# Altium schematic sheet M7.SchDoc
size A0; Organization: Altium Limited; Address1: L3, 12a Rodborough Rd; Address2: Frenchs Forest; Address3: NSW; Address4: Australia 2086
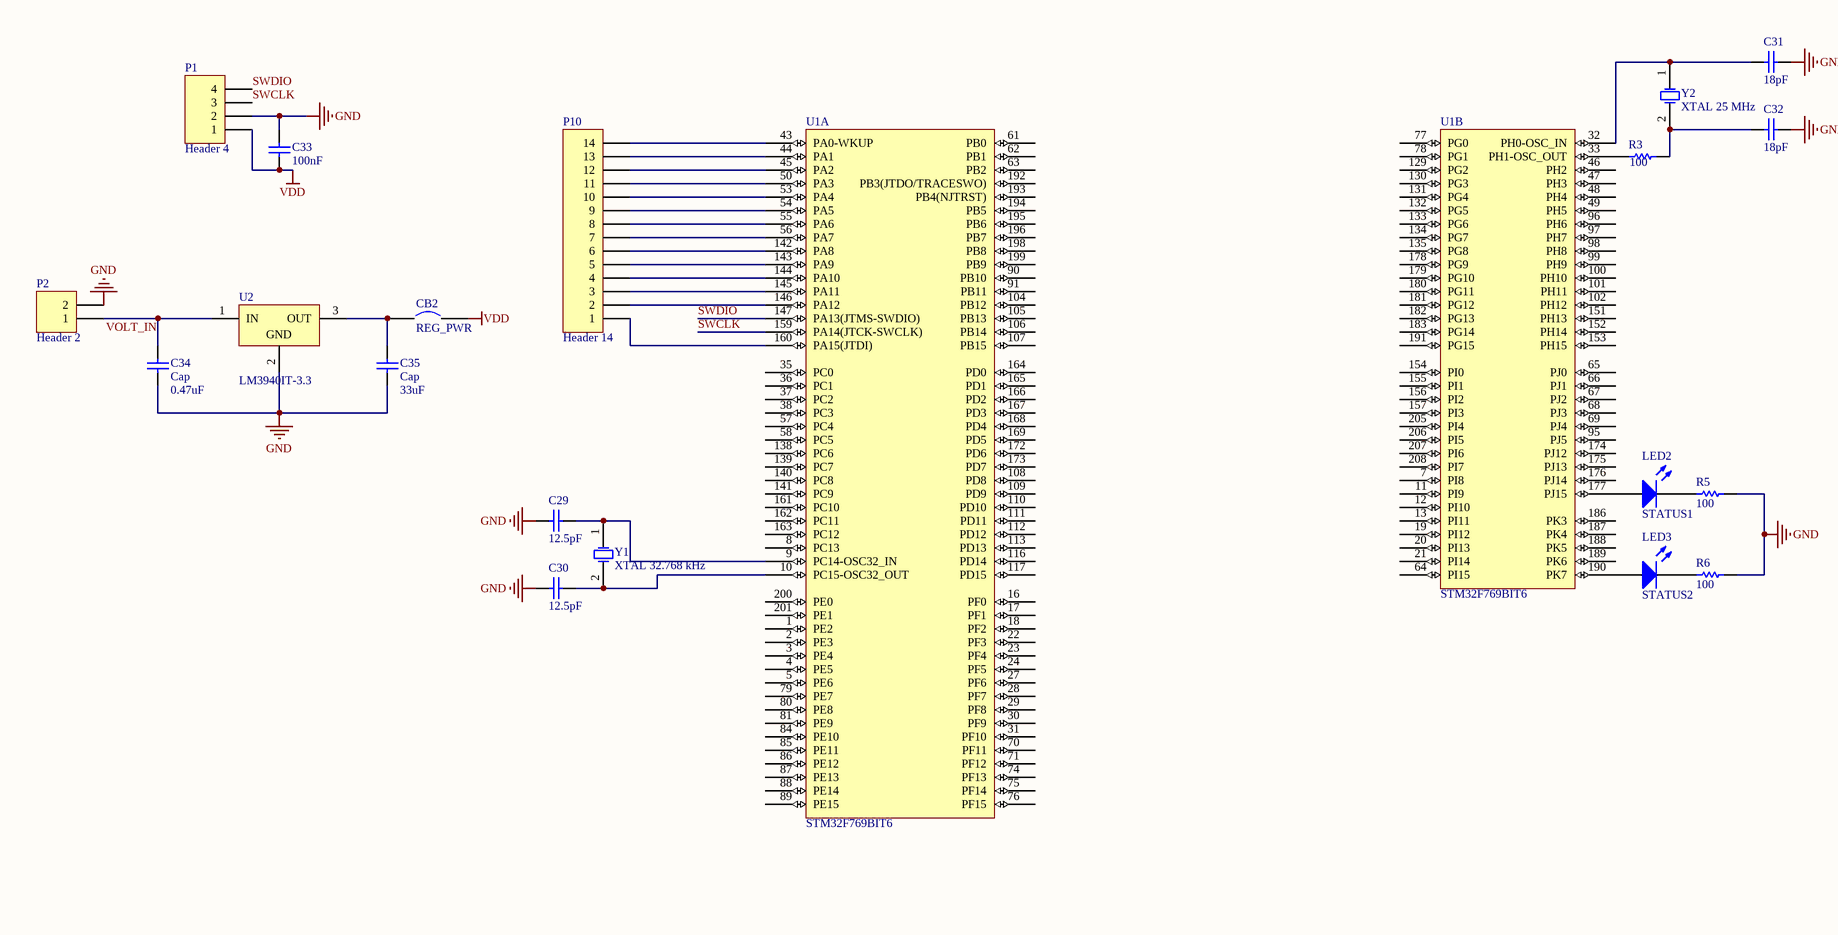
[diagram p0: M7.SchDoc, left]
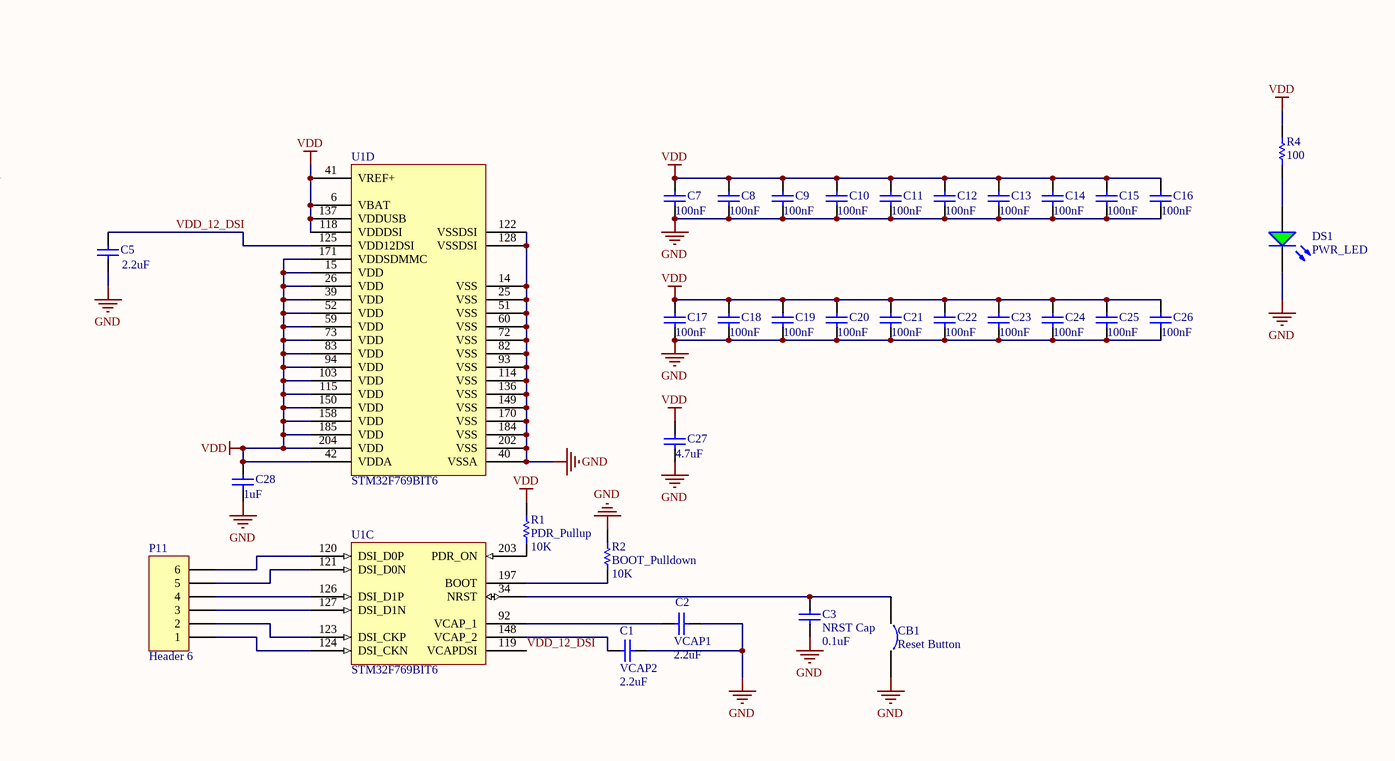
[diagram p1: M7.SchDoc, right]

## Parts
C1  VCAP2  value 2.2uF  [C1206]
C2  VCAP1  value 2.2uF  [C1206]
C3  NRST Cap  value 0.1uF  [C1206]
C5  value 2.2uF  [C1206]  (hidden comment: DSI_Filter2)
C7  value 100nF  [C1206]  (hidden comment: DSI_Filter3)
C8  value 100nF  [C1206]  (hidden comment: DSI_Filter3)
C9  value 100nF  [C1206]  (hidden comment: DSI_Filter3)
C10  value 100nF  [C1206]  (hidden comment: DSI_Filter3)
C11  value 100nF  [C1206]  (hidden comment: DSI_Filter3)
C12  value 100nF  [C1206]  (hidden comment: DSI_Filter3)
C13  value 100nF  [C1206]  (hidden comment: DSI_Filter3)
C14  value 100nF  [C1206]  (hidden comment: DSI_Filter3)
C15  value 100nF  [C1206]  (hidden comment: DSI_Filter3)
C16  value 100nF  [C1206]  (hidden comment: DSI_Filter3)
C17  value 100nF  [C1206]  (hidden comment: DSI_Filter3)
C18  value 100nF  [C1206]  (hidden comment: DSI_Filter3)
C19  value 100nF  [C1206]  (hidden comment: DSI_Filter3)
C20  value 100nF  [C1206]  (hidden comment: DSI_Filter3)
C21  value 100nF  [C1206]  (hidden comment: DSI_Filter3)
C22  value 100nF  [C1206]  (hidden comment: DSI_Filter3)
C23  value 100nF  [C1206]  (hidden comment: DSI_Filter3)
C24  value 100nF  [C1206]  (hidden comment: DSI_Filter3)
C25  value 100nF  [C1206]  (hidden comment: DSI_Filter3)
C26  value 100nF  [C1206]  (hidden comment: DSI_Filter3)
C27  value 4.7uF  [C1206]  (hidden comment: DSI_Filter3)
C28  value 1uF  [C1206]  (hidden comment: DSI_Filter3)
C29  value 12.5pF  [C1206]  (hidden comment: DSI_Filter3)
C30  value 12.5pF  [C1206]  (hidden comment: DSI_Filter3)
C31  value 18pF  [C1206]  (hidden comment: DSI_Filter3)
C32  value 18pF  [C1206]  (hidden comment: DSI_Filter3)
C33  value 100nF  [C1206]  (hidden comment: DSI_Filter3)
C34  Cap  value 0.47uF  [RAD-0.3]
C35  Cap  value 33uF  [RAD-0.3]
CB1  Reset Button  [SPST-2]
CB2  REG_PWR  [SPST-2]
DS1  PWR_LED  [AVAG-HLMP-4740]
LED2  STATUS1  [Type 5mm]
LED3  STATUS2  [Type 5mm]
P1  Header 4  [HDR1X4]
P2  Header 2  [HDR1X2]
P10  Header 14  [HDR1X14]
P11  Header 6  [HDR1X6]
R1  PDR_Pullup  value 10K  [AXIAL-0.3]
R2  BOOT_Pulldown  value 10K  [AXIAL-0.3]
R3  value 100  [AXIAL-0.3]  (hidden comment: Inverter_Lim)
R4  value 100  [AXIAL-0.3]  (hidden comment: Inverter_Lim)
R5  value 100  [AXIAL-0.3]  (hidden comment: Inverter_Lim)
R6  value 100  [AXIAL-0.3]  (hidden comment: Inverter_Lim)
U1  STM32F769BIT6  [STM-LQFP208_V]  (parts A,B,C,D of 4)
U2  LM3940IT-3.3  [NDE0003A]
Y1  XTAL 32.768 kHz  [R38]
Y2  XTAL 25 MHz  [R38]

## Nets
GND: C1.2 C2.2 C3.1 C5.1 C7.1 C8.1 C9.1 C10.1 C11.1 C12.1 C13.1 C14.1 C15.1 C16.1 C17.1 C18.1 C19.1 C20.1 C21.1 C22.1 C23.1 C24.1 C25.1 C26.1 C27.1 C28.1 C29.2 C30.2 C31.1 C32.1 C33.1 C34.1 C35.1 CB1.2 DS1.2(K) P1.2 P2.2 R2.1 R5.2 R6.2 U1.14(VSS) U1.25(VSS) U1.40(VSSA) U1.51(VSS) U1.60(VSS) U1.72(VSS) U1.82(VSS) U1.93(VSS) U1.114(VSS) U1.122(VSSDSI) U1.128(VSSDSI) U1.136(VSS) U1.149(VSS) U1.170(VSS) U1.184(VSS) U1.202(VSS) U2.2(GND)
VDD: C7.2 C8.2 C9.2 C10.2 C11.2 C12.2 C13.2 C14.2 C15.2 C16.2 C17.2 C18.2 C19.2 C20.2 C21.2 C22.2 C23.2 C24.2 C25.2 C26.2 C27.2 C28.2 C33.2 CB2.2 P1.1 R1.2 R4.1 U1.6(VBAT) U1.15(VDD) U1.26(VDD) U1.39(VDD) U1.41(VREF+) U1.42(VDDA) U1.52(VDD) U1.59(VDD) U1.73(VDD) U1.83(VDD) U1.94(VDD) U1.103(VDD) U1.115(VDD) U1.118(VDDDSI) U1.137(VDDUSB) U1.150(VDD) U1.158(VDD) U1.171(VDDSDMMC) U1.185(VDD) U1.204(VDD)
SWCLK: P1.3 U1.159(PA14(JTCK-SWCLK))
SWDIO: P1.4 U1.147(PA13(JTMS-SWDIO))
VDD_12_DSI: C5.2 U1.119(VCAPDSI) U1.125(VDD12DSI)
VOLT_IN: C34.2 P2.1 U2.1(IN)
NetC1_1: C1.1 U1.148(VCAP_2)
NetC2_1: C2.1 U1.92(VCAP_1)
NetC3_2: C3.2 CB1.1 U1.34(NRST)
NetC29_1: C29.1 U1.9(PC14-OSC32_IN) Y1.1(OSC1)
NetC30_1: C30.1 U1.10(PC15-OSC32_OUT) Y1.2(OSC2)
NetC31_2: C31.2 U1.32(PH0-OSC_IN) Y2.1(OSC1)
NetC32_2: C32.2 R3.1 Y2.2(OSC2)
NetC35_2: C35.2 CB2.1 U2.3(OUT)
NetDS1_1: DS1.1(A) R4.2
NetLED2_1: LED2.1(K) R5.1
NetLED2_2: LED2.2(A) U1.177(PJ15)
NetLED3_1: LED3.1(K) R6.1
NetLED3_2: LED3.2(A) U1.190(PK7)
NetP10_1: P10.1 U1.160(PA15(JTDI))
NetP10_2: P10.2 U1.146(PA12)
NetP10_3: P10.3 U1.145(PA11)
NetP10_4: P10.4 U1.144(PA10)
NetP10_5: P10.5 U1.143(PA9)
NetP10_6: P10.6 U1.142(PA8)
NetP10_7: P10.7 U1.56(PA7)
NetP10_8: P10.8 U1.55(PA6)
NetP10_9: P10.9 U1.54(PA5)
NetP10_10: P10.10 U1.53(PA4)
NetP10_11: P10.11 U1.50(PA3)
NetP10_12: P10.12 U1.45(PA2)
NetP10_13: P10.13 U1.44(PA1)
NetP10_14: P10.14 U1.43(PA0-WKUP)
NetP11_1: P11.1 U1.124(DSI_CKN)
NetP11_2: P11.2 U1.123(DSI_CKP)
NetP11_3: P11.3 U1.127(DSI_D1N)
NetP11_4: P11.4 U1.126(DSI_D1P)
NetP11_5: P11.5 U1.121(DSI_D0N)
NetP11_6: P11.6 U1.120(DSI_D0P)
NetR1_1: R1.1 U1.203(PDR_ON)
NetR2_2: R2.2 U1.197(BOOT)
NetR3_2: R3.2 U1.33(PH1-OSC_OUT)

Not connected (* = marked no-connect by the designer): U1 1(PE2) 2(PE3) 3(PE4) 4(PE5) 5(PE6) 7(PI8) 8(PC13) 11(PI9) 12(PI10) 13(PI11) 16(PF0) 17(PF1) 18(PF2) 19(PI12) 20(PI13) 21(PI14) 22(PF3) 23(PF4) 24(PF5) 27(PF6) 28(PF7) 29(PF8) 30(PF9) 31(PF10) 35(PC0) 36(PC1) 37(PC2) 38(PC3) 46(PH2) 47(PH3) 48(PH4) 49(PH5) 57(PC4) 58(PC5) 61(PB0) 62(PB1) 63(PB2) 64(PI15) 65(PJ0) 66(PJ1) 67(PJ2) 68(PJ3) 69(PJ4) 70(PF11) 71(PF12) 74(PF13) 75(PF14) 76(PF15) 77(PG0) 78(PG1) 79(PE7) 80(PE8) 81(PE9) 84(PE10) 85(PE11) 86(PE12) 87(PE13) 88(PE14) 89(PE15) 90(PB10) 91(PB11) 95(PJ5) 96(PH6) 97(PH7) 98(PH8) 99(PH9) 100(PH10) 101(PH11) 102(PH12) 104(PB12) 105(PB13) 106(PB14) 107(PB15) 108(PD8) 109(PD9) 110(PD10) 111(PD11) 112(PD12) 113(PD13) 116(PD14) 117(PD15) 129(PG2) 130(PG3) 131(PG4) 132(PG5) 133(PG6) 134(PG7) 135(PG8) 138(PC6) 139(PC7) 140(PC8) 141(PC9) 151(PH13) 152(PH14) 153(PH15) 154(PI0) 155(PI1) 156(PI2) 157(PI3) 161(PC10) 162(PC11) 163(PC12) 164(PD0) 165(PD1) 166(PD2) 167(PD3) 168(PD4) 169(PD5) 172(PD6) 173(PD7) 174(PJ12) 175(PJ13) 176(PJ14) 178(PG9) 179(PG10) 180(PG11) 181(PG12) 182(PG13) 183(PG14) 186(PK3) 187(PK4) 188(PK5) 189(PK6) 191(PG15) 192(PB3(JTDO/TRACESWO)) 193(PB4(NJTRST)) 194(PB5) 195(PB6) 196(PB7) 198(PB8) 199(PB9) 200(PE0) 201(PE1) 205(PI4) 206(PI5) 207(PI6) 208(PI7)

## Notes on the sheet
- Title
- Size:
- Date:
- File:
- A0
- Number:
- Time:
- Revision:
- Sheet
- of

## Library data of the parts
C1-C3 C5 C7-C33 = Cap Semi: Capacitor (Semiconductor SIM Model); Published: 8-Jun-2000; LatestRevisionDate: 29-May-2009; LatestRevisionNote: IPC-7351 Footprint Added.; PackageReference: C1206; Publisher: Altium Limited; PackageDescription: Chip Capacitor
C34 C35 = Cap: Capacitor; Published: 8-Jun-2000; LatestRevisionDate: 17-Jul-2002; LatestRevisionNote: Re-released for DXP Platform.; PackageReference: RAD-0.3; Publisher: Altium Limited; PackageDescription: Radial Cap, Thru-Hole; 2 Leads; 0.3 in Pin Spacing
CB1 CB2 = Circuit Breaker: Published: 24-Mar-1999; LatestRevisionDate: 17-Jul-2002; LatestRevisionNote: Re-released for DXP Platform.; PackageReference: SPST-2; Publisher: Altium Limited; PackageDescription: Switch; 2 Leads
DS1 = CMP-2000-06413-1: T-1 3/4 (5 mm) Low Current LED Lamp, Green, 1.9 V, -20 to 100 degC, 2-Pin THD, RoHS, Bulk; Manufacturer: AvagoTechnologies; Type: Uni-Color; Peak Wavelength: 565nm; Rad Hard: No; Viewing Angle: 50°; Dominant Wavelength/Color Temperature: 569nm; Number of LEDs: 1; Lens Appearance: ColoredDiffused; Lens Shape Type: Circular; Mounting Orientation: TopMount; Intensity: 2.3mcd; Datasheet Version: 07/2014; Category: LEDs; Datasheet URL: http://docs.avagotech.com/docs/AV02-1557EN; Packaging: Bulk; Pin Count: 2; Mounting Technology: ThroughHole; Package Reference: HLMP-4740; Mounting: ThroughHole; Manufacturer URL: http://www.avagotech.com/; Color: Green; Package: 2T-13/4; Package Description: 2-Pin Through Hole Device, Dia 5.845 mm, Pitch 2.54 mm
LED2 LED3 = CMP-1489-00006-1: THT LED round mono-color waterclear, WL-TMRW ,Blue; Manufacturer: Wuerth Elektronik; PartNumber: 151053BS04500; ComponentLink1URL: http://www.we-online.com; ComponentLink2URL: http://katalog.we-online.de/pbs/datasheet/7448042001.pdfhttp://katalog.we-online.de/pbs/datasheet/7448042001.pdfhttp://katalog.we-online.de/pbs/datasheet/7448042001.pdfhttp://katalog.we-online.de/pbs/datasheet/151053BS04500.pdf; PackageReference: Type 5mm; ComponentLink1Description: Manufacturer URL; Emitting color: Blue; ComponentLink2Description: Datasheet
P1 = Header 4: Header, 4-Pin; LatestRevisionDate: 17-Jul-2002; LatestRevisionNote: Re-released for DXP Platform.; Publisher: Altium Limited
P2 = Header 2: Header, 2-Pin; LatestRevisionDate: 17-Jul-2002; LatestRevisionNote: Re-released for DXP Platform.; Publisher: Altium Limited
P10 = Header 14: Header, 14-Pin; LatestRevisionDate: 17-Jul-2002; LatestRevisionNote: Re-released for DXP Platform.; Publisher: Altium Limited
P11 = Header 6: Header, 6-Pin; LatestRevisionDate: 17-Jul-2002; LatestRevisionNote: Re-released for DXP Platform.; Publisher: Altium Limited
R1-R6 = Res1: Resistor; Published: 8-Jun-2000; LatestRevisionDate: 17-Jul-2002; LatestRevisionNote: Re-released for DXP Platform.; PackageReference: AXIAL-0.3; Publisher: Altium Limited; PackageDescription: Axial Device, Thru-Hole; 2 Leads; 0.3 in Pin Spacing
U1 = CMP-2000-07163-1: ARM-Based Cortex-M7 32 Bit MCU+FPU, 462 DMIPS, 2048 kB Flash, 512 kB SRAM, 168 I/Os, -40 to 85 degC, 208-Pin LQFP, RoHS, Tray; Manufacturer: STMicroelectronics; No. of Pins: 208Pins; Supply Voltage Max: 3.6V; RAM Memory Size: 512KB; Program Memory Size: 2MB; Architecture: ARMCortex-M7; Embedded Interface Type: CAN,Ethernet,I2C,I2S,SPI,UART,USART,USB; Supply Voltage Min: 1.7V; CPU Speed: 216MHz; Product Range: STM32F7ARMCortex-M7Microcontrollers; No. of I/O's: 168I/O's; SVHC: NoSVHC(17-Dec-2015); Datasheet Version: Rev. 3, 05/2016; Manufacturer URL: http://www.st.com/; Packaging: Each; Automotive Qualification Standard: -; Mounting Technology: SurfaceMount; MCU Case Style: LQFP; MSL: MSL3-168hours; Datasheet URL: http://www.st.com/resource/en/datasheet/stm32f769bi.pdf; Package Reference: LQFP-208; Package Description: 208-Pin Low Profile Quad Flat Package, 28 x 28 mm Body, 0.5 mm Pitch
U2 = CMP-0062-02465-3: 1A Low Dropout Regulator for 5V to 3.3V Conversion, 3-pin TO-220; Manufacturer: Texas Instruments; CompType: LDO IC; PowerWise: N; PackageTopMarking: NSUZXYTTE#*LM3940IT*-3.3 P+; PackageDescription: TO-220, Molded, 3 Lead, Straight; PinCount: 3; ComponentLink1Description: Datasheet URL; ComponentLink1URL: http://www.ti.com/general/docs/lit/getliterature.tsp?genericPartNumber=LM3940&fileType=pdf; PackageReference: NDE0003A; RoHS: N
Y1 Y2 = XTAL: Crystal Oscillator; Published: 8-Jun-2000; LatestRevisionDate: 17-Jul-2002; LatestRevisionNote: Re-released for DXP Platform.; PackageReference: R38; Publisher: Altium Limited; PackageDescription: Crystal, Thru-Hole; 2 Leads; Body 3.1 x 8.2 mm (Dia.xH)